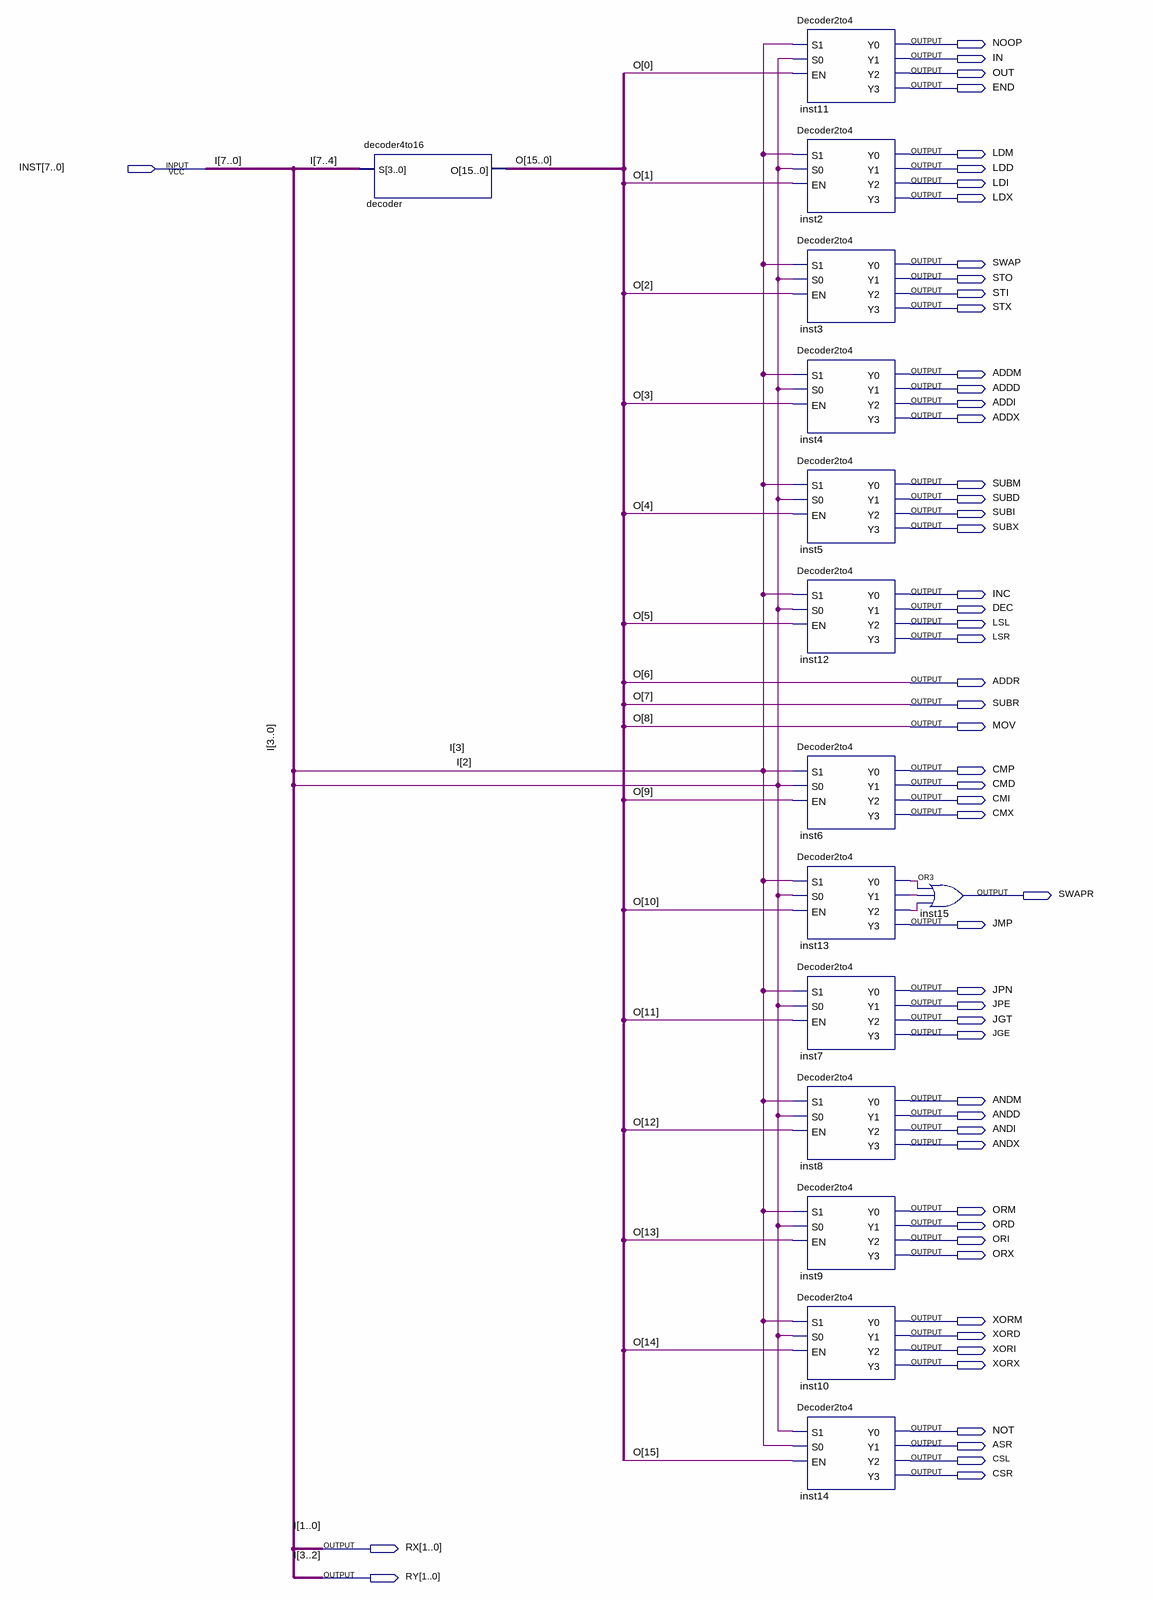
[diagram p0: schematic sheet]
// Quartus schematic Opcode_decoder.bdf as structural Verilog: 15 symbols, 56 pins
module Opcode_decoder (
  input  [7:0] INST,
  output NOOP,
  output IN,
  output OUT,
  output END,
  output LDM,
  output LDD,
  output LDI,
  output LDX,
  output SWAP,
  output STO,
  output STI,
  output STX,
  output ADDM,
  output ADDD,
  output ADDI,
  output ADDX,
  output SUBM,
  output SUBD,
  output SUBI,
  output SUBX,
  output INC,
  output DEC,
  output LSL,
  output LSR,
  output ADDR,
  output SUBR,
  output MOV,
  output CMP,
  output CMD,
  output CMI,
  output CMX,
  output SWAPR,
  output JMP,
  output JPN,
  output JPE,
  output JGT,
  output JGE,
  output ANDM,
  output ANDD,
  output ANDI,
  output ANDX,
  output ORM,
  output ORD,
  output ORI,
  output ORX,
  output XORM,
  output XORD,
  output XORI,
  output XORX,
  output NOT,
  output ASR,
  output CSL,
  output CSR,
  output [1:0] RX,
  output [1:0] RY
);

  wire inst13_y0, inst13_y1, inst13_y2;
  wire [15:0] O;

  decoder4to16 decoder (.S(INST[7:4]), .O({O[15:9], MOV, SUBR, ADDR, O[5:0]}));
  Decoder2to4 inst11 (.S1(INST[3]), .S0(INST[2]), .EN(O[0]), .Y0(NOOP), .Y1(IN), .Y2(OUT), .Y3(END));
  Decoder2to4 inst2 (.S1(INST[3]), .S0(INST[2]), .EN(O[1]), .Y0(LDM), .Y1(LDD), .Y2(LDI), .Y3(LDX));
  Decoder2to4 inst3 (.S1(INST[3]), .S0(INST[2]), .EN(O[2]), .Y0(SWAP), .Y1(STO), .Y2(STI), .Y3(STX));
  Decoder2to4 inst4 (.S1(INST[3]), .S0(INST[2]), .EN(O[3]), .Y0(ADDM), .Y1(ADDD), .Y2(ADDI), .Y3(ADDX));
  Decoder2to4 inst5 (.S1(INST[3]), .S0(INST[2]), .EN(O[4]), .Y0(SUBM), .Y1(SUBD), .Y2(SUBI), .Y3(SUBX));
  Decoder2to4 inst12 (.S1(INST[3]), .S0(INST[2]), .EN(O[5]), .Y0(INC), .Y1(DEC), .Y2(LSL), .Y3(LSR));
  Decoder2to4 inst6 (.S1(INST[3]), .S0(INST[2]), .EN(O[9]), .Y0(CMP), .Y1(CMD), .Y2(CMI), .Y3(CMX));
  Decoder2to4 inst13 (.S1(INST[3]), .S0(INST[2]), .EN(O[10]), .Y0(inst13_y0), .Y1(inst13_y1), .Y2(inst13_y2), .Y3(JMP));
  Decoder2to4 inst7 (.S1(INST[3]), .S0(INST[2]), .EN(O[11]), .Y0(JPN), .Y1(JPE), .Y2(JGT), .Y3(JGE));
  Decoder2to4 inst8 (.S1(INST[3]), .S0(INST[2]), .EN(O[12]), .Y0(ANDM), .Y1(ANDD), .Y2(ANDI), .Y3(ANDX));
  Decoder2to4 inst9 (.S1(INST[3]), .S0(INST[2]), .EN(O[13]), .Y0(ORM), .Y1(ORD), .Y2(ORI), .Y3(ORX));
  Decoder2to4 inst10 (.S1(INST[3]), .S0(INST[2]), .EN(O[14]), .Y0(XORM), .Y1(XORD), .Y2(XORI), .Y3(XORX));
  Decoder2to4 inst14 (.S1(INST[2]), .S0(INST[3]), .EN(O[15]), .Y0(NOT), .Y1(ASR), .Y2(CSL), .Y3(CSR));
  or inst15 (SWAPR, inst13_y0, inst13_y1, inst13_y2);

  assign RX = INST[1:0];
  assign RY = INST[3:2];

  // Other names for the same wires on the sheet: I[7:0] = INST; O[8:6] = {MOV, SUBR, ADDR}
endmodule
